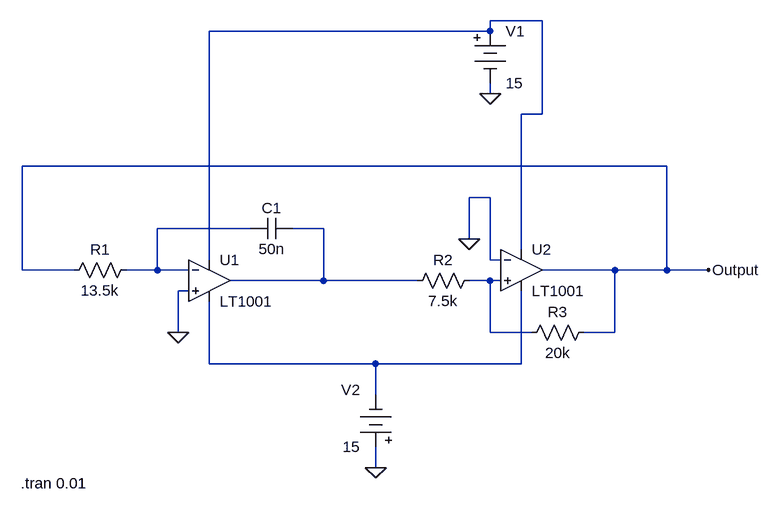
[diagram p0: schematic Square WaveForm Generator.asc]
Square WaveForm Generator.asc, the LTspice schematic file:
Version 4
SHEET 1 948 680
WIRE 592 -272 512 -272
WIRE 512 -256 512 -272
WIRE 512 -256 80 -256
WIRE 512 -160 512 -176
WIRE 592 -128 592 -272
WIRE 592 -128 560 -128
WIRE 784 -48 -208 -48
WIRE 512 0 480 0
WIRE 144 48 0 48
WIRE 256 48 208 48
WIRE 480 64 480 0
WIRE 560 80 560 -128
WIRE 80 96 80 -256
WIRE 512 96 512 0
WIRE 528 96 512 96
WIRE -208 112 -208 -48
WIRE -128 112 -208 112
WIRE 0 112 0 48
WIRE 0 112 -48 112
WIRE 48 112 0 112
WIRE 704 112 592 112
WIRE 784 112 784 -48
WIRE 784 112 704 112
WIRE 848 112 784 112
WIRE 256 128 256 48
WIRE 256 128 112 128
WIRE 400 128 256 128
WIRE 512 128 480 128
WIRE 528 128 512 128
WIRE 48 144 32 144
WIRE 32 208 32 144
WIRE 512 208 512 128
WIRE 576 208 512 208
WIRE 704 208 704 112
WIRE 704 208 656 208
WIRE 80 256 80 160
WIRE 336 256 80 256
WIRE 560 256 560 144
WIRE 560 256 336 256
WIRE 336 304 336 256
WIRE 336 416 336 384
FLAG 32 208 0
FLAG 512 -160 0
FLAG 480 64 0
FLAG 336 416 0
FLAG 848 112 Output
SYMBOL OpAmps\\LT1001 80 64 R0
SYMATTR InstName U1
SYMBOL res -32 96 R90
WINDOW 0 0 56 VBottom 2
WINDOW 3 32 56 VTop 2
SYMATTR InstName R1
SYMATTR Value 13.5k
SYMBOL cap 208 32 R90
WINDOW 0 0 32 VBottom 2
WINDOW 3 32 32 VTop 2
SYMATTR InstName C1
SYMATTR Value 50n
SYMBOL Misc\\battery 512 -272 R0
SYMATTR InstName V1
SYMATTR Value 15
SYMBOL OpAmps\\LT1001 560 48 R0
SYMATTR InstName U2
SYMBOL res 496 112 R90
WINDOW 0 0 56 VBottom 2
WINDOW 3 32 56 VTop 2
SYMATTR InstName R2
SYMATTR Value 7.5k
SYMBOL res 672 192 R90
WINDOW 0 0 56 VBottom 2
WINDOW 3 32 56 VTop 2
SYMATTR InstName R3
SYMATTR Value 20k
SYMBOL Misc\\battery 336 400 R180
WINDOW 0 24 104 Left 2
WINDOW 3 24 16 Left 2
SYMATTR InstName V2
SYMATTR Value 15
TEXT -210 440 Left 2 !.tran 0.01

The netlist it stands for:
* Square WaveForm Generator.asc
XU1 0 N002 N001 N005 N003 LT1001  ; pins In+ In- V+ V- OUT
R1 N002 Output 13.5k
C1 N003 N002 50n
V1 N001 0 15
XU2 N004 0 N001 N005 Output LT1001  ; pins In+ In- V+ V- OUT
R2 N004 N003 7.5k
R3 Output N004 20k
V2 0 N005 15
.tran 0.01
.lib LTC.lib
.backanno
.end